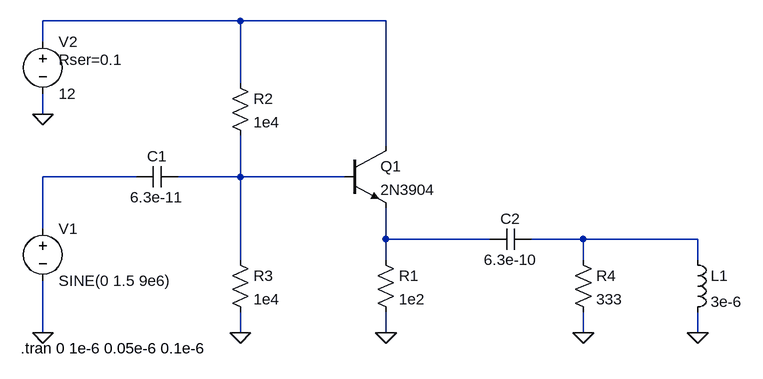
[diagram p0: schematic emitter_follower.asc]
emitter_follower.asc, the LTspice schematic file:
Version 4
SHEET 1 880 680
WIRE 0 -96 -304 -96
WIRE 224 -96 0 -96
WIRE -304 -64 -304 -96
WIRE 0 0 0 -96
WIRE -304 48 -304 16
WIRE 224 96 224 -96
WIRE -160 144 -304 144
WIRE 0 144 0 80
WIRE 0 144 -96 144
WIRE 160 144 0 144
WIRE -304 224 -304 144
WIRE 224 240 224 192
WIRE 384 240 224 240
WIRE 528 240 448 240
WIRE 704 240 528 240
WIRE 0 272 0 144
WIRE 224 272 224 240
WIRE 528 272 528 240
WIRE 704 272 704 240
WIRE -304 384 -304 304
WIRE 0 384 0 352
WIRE 224 384 224 352
WIRE 528 384 528 352
WIRE 704 384 704 352
FLAG 0 384 0
FLAG 224 384 0
FLAG -304 48 0
FLAG -304 384 0
FLAG 528 384 0
FLAG 704 384 0
SYMBOL npn 160 96 R0
SYMATTR InstName Q1
SYMATTR Value 2N3904
SYMBOL res 208 256 R0
SYMATTR InstName R1
SYMATTR Value 1e2
SYMBOL res -16 -16 R0
SYMATTR InstName R2
SYMATTR Value 1e4
SYMBOL res -16 256 R0
SYMATTR InstName R3
SYMATTR Value 1e4
SYMBOL cap -96 128 R90
WINDOW 0 0 32 VBottom 2
WINDOW 3 32 32 VTop 2
SYMATTR InstName C1
SYMATTR Value 6.3e-11
SYMBOL cap 448 224 R90
WINDOW 0 0 32 VBottom 2
WINDOW 3 32 32 VTop 2
SYMATTR InstName C2
SYMATTR Value 6.3e-10
SYMBOL voltage -304 208 R0
WINDOW 123 0 0 Left 0
WINDOW 39 0 0 Left 0
SYMATTR InstName V1
SYMATTR Value SINE(0 1.5 9e6)
SYMBOL voltage -304 -80 R0
WINDOW 123 0 0 Left 0
WINDOW 39 24 44 Left 2
SYMATTR InstName V2
SYMATTR Value 12
SYMATTR SpiceLine Rser=0.1
SYMBOL res 512 256 R0
SYMATTR InstName R4
SYMATTR Value 333
SYMBOL ind 688 256 R0
SYMATTR InstName L1
SYMATTR Value 3e-6
SYMATTR SpiceLine Rser=0
TEXT -338 408 Left 2 !.tran 0 1e-6 0.05e-6 0.1e-6

The netlist it stands for:
* emitter_follower.asc
Q1 N001 N003 N004 0 2N3904
R1 N004 0 1e2
R2 N001 N003 1e4
R3 N003 0 1e4
C1 N003 N002 6.3e-11
C2 N005 N004 6.3e-10
V1 N002 0 SINE(0 1.5 9e6)
V2 N001 0 12 Rser=0.1
R4 N005 0 333
L1 N005 0 3e-6 Rser=0
.model NPN NPN
.model PNP PNP
.lib standard.bjt
.tran 0 1e-6 0.05e-6 0.1e-6
.backanno
.end